# Altium schematic sheet Temperature_humidity.SchDoc: Temperature / Humidity
size Letter; DrawnBy: D. Fusi; DocumentNumber: 2; Revision: PVT; SheetNumber: 2; SheetTotal: 3
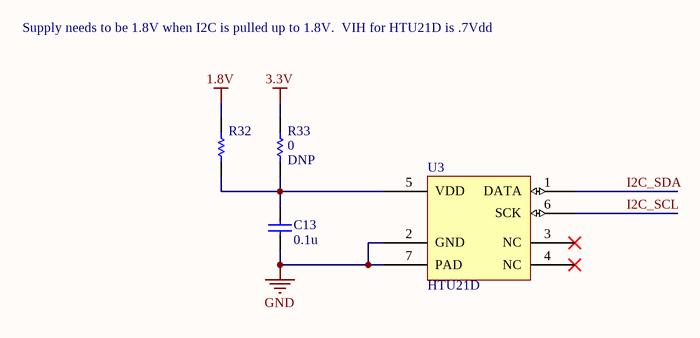
[diagram p0: Temperature_humidity.SchDoc]

## Parts
C13  0.1u  [CAP0603]
R32  R_0_jumper_0.1_0402  [RES0402-SENSE-DVT]  (value not drawn)
R33  DNP  value 0  [RES0402-SENSE-DVT]
U3  HTU21D  [HTU2xx]

## Nets
1.8V: R32.2
3.3V: R33.2
GND: C13.1 U3.2(GND) U3.7(PAD)
I2C_SCL: U3.6(SCK)
I2C_SDA: U3.1(DATA)
NetC13_2: C13.2 R32.1 R33.1 U3.5(VDD)

Not connected (* = marked no-connect by the designer): U3 3(NC)* 4(NC)*

## Notes on the sheet
- Supply needs to be 1.8V when I2C is pulled up to 1.8V.  VIH for HTU21D is .7Vdd
- TITLE
- DATE
- DRAWN BY
- REV
- SHEET
- OF

## Library data of the parts
C13 = C_0.1u_10_50_X7R_0603: CAP CER 0.1UF 50V 10% X7R 0603; Vendor: Yageo; PN: CC0603KRX7R9BB104; Hello_PN: 225-00041; item_category: Capacitor; Value: 0.1u; Size: 0603; Tolerance: 10%; Voltage: 50V; Temp: X7R
R32 = R_0_jumper_0.1_0402: RES SMD 0.0 OHM JUMPER 1/16W; Value: 0; Vendor: Yageo; PN: RC0402JR-070RL; Hello_PN: 220-00408; item_category: Resistor; Model: *; Tolerance: Jumper; Power: 1/16W; Size: 0402
R33 = R_0_jumper_0.1_0402: RES SMD 0.0 OHM JUMPER 1/16W; Vendor: Yageo; PN: RC0402JR-070RL; Hello_PN: 220-00408; item_category: Resistor; Model: *; Tolerance: Jumper; Power: 1/16W; Size: 0402
U3 = HTU21D: Meas-spec T/H sensor; Vendor: Measurement specialties; Hello_PN: 265-00196; item_category: IC Mixed Signal; PN: HTU21D